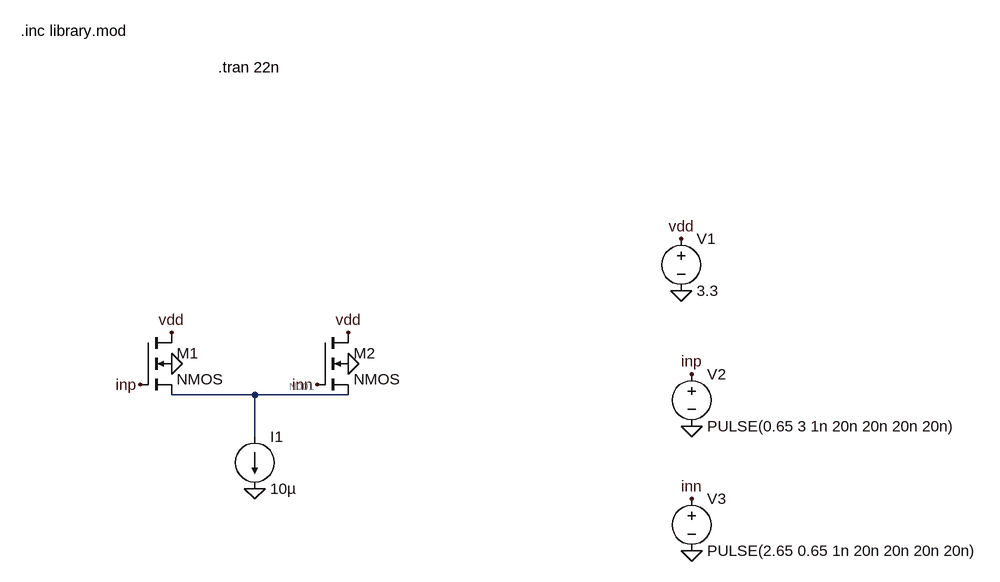
[diagram p0: schematic Draft8.asc]
Draft8.asc, the LTspice schematic file:
Version 4
SHEET 1 1368 1028
WIRE 224 432 96 432
WIRE 368 432 224 432
WIRE 224 496 224 432
FLAG 880 272 0
FLAG 880 192 vdd
FLAG 896 480 0
FLAG 896 672 0
FLAG 96 384 0
FLAG 368 384 0
FLAG 96 336 vdd
FLAG 368 336 vdd
FLAG 896 400 inp
FLAG 896 592 inn
FLAG 224 576 0
FLAG 48 416 inp
FLAG 320 416 inn
SYMBOL voltage 880 176 R0
WINDOW 123 0 0 Left 0
WINDOW 39 0 0 Left 0
SYMATTR InstName V1
SYMATTR Value 3.3
SYMBOL nmos4 48 336 R0
SYMATTR InstName M1
SYMATTR Value2 l=0.35u w=1u
SYMBOL nmos4 320 336 R0
SYMATTR InstName M2
SYMATTR Value2 l=0.35u w=5u
SYMBOL voltage 896 384 R0
WINDOW 123 0 0 Left 0
WINDOW 39 0 0 Left 0
SYMATTR InstName V2
SYMATTR Value PULSE(0.65 3 1n 20n 20n 20n 20n)
SYMBOL voltage 896 576 R0
WINDOW 123 0 0 Left 0
WINDOW 39 0 0 Left 0
SYMATTR InstName V3
SYMATTR Value PULSE(2.65 0.65 1n 20n 20n 20n 20n)
SYMBOL current 224 496 R0
WINDOW 123 0 0 Left 0
WINDOW 39 0 0 Left 0
SYMATTR InstName I1
SYMATTR Value 10µ
TEXT -136 -128 Left 2 !.inc library.mod
TEXT 168 -72 Left 2 !.tran 22n

The netlist it stands for:
* Draft8.asc
V1 vdd 0 3.3
M1 vdd inp N001 0 NMOS l=0.35u w=1u
M2 vdd inn N001 0 NMOS l=0.35u w=5u
V2 inp 0 PULSE(0.65 3 1n 20n 20n 20n 20n)
V3 inn 0 PULSE(2.65 0.65 1n 20n 20n 20n 20n)
I1 N001 0 10µ
.model NMOS NMOS
.model PMOS PMOS
.lib standard.mos
.inc library.mod
.tran 22n
.backanno
.end

* Results of the author's LTspice run, read from the files saved beside the schematic
* Operating Point, zero values left out:
*   V(vdd) = 3.3 V
*   V(inp) = 650 mV
*   V(n001) = 1.705 V
*   V(inn) = 2.65 V
*   Id(M2) = 10 µA
*   Ib(M2) = -5.025 pA
*   Is(M2) = -10 µA
*   Id(M1) = 3.31 pA
*   Ib(M1) = -5.025 pA
*   Is(M1) = 1.715 pA
*   I(I1) = 10 µA
*   I(V1) = -10 µA